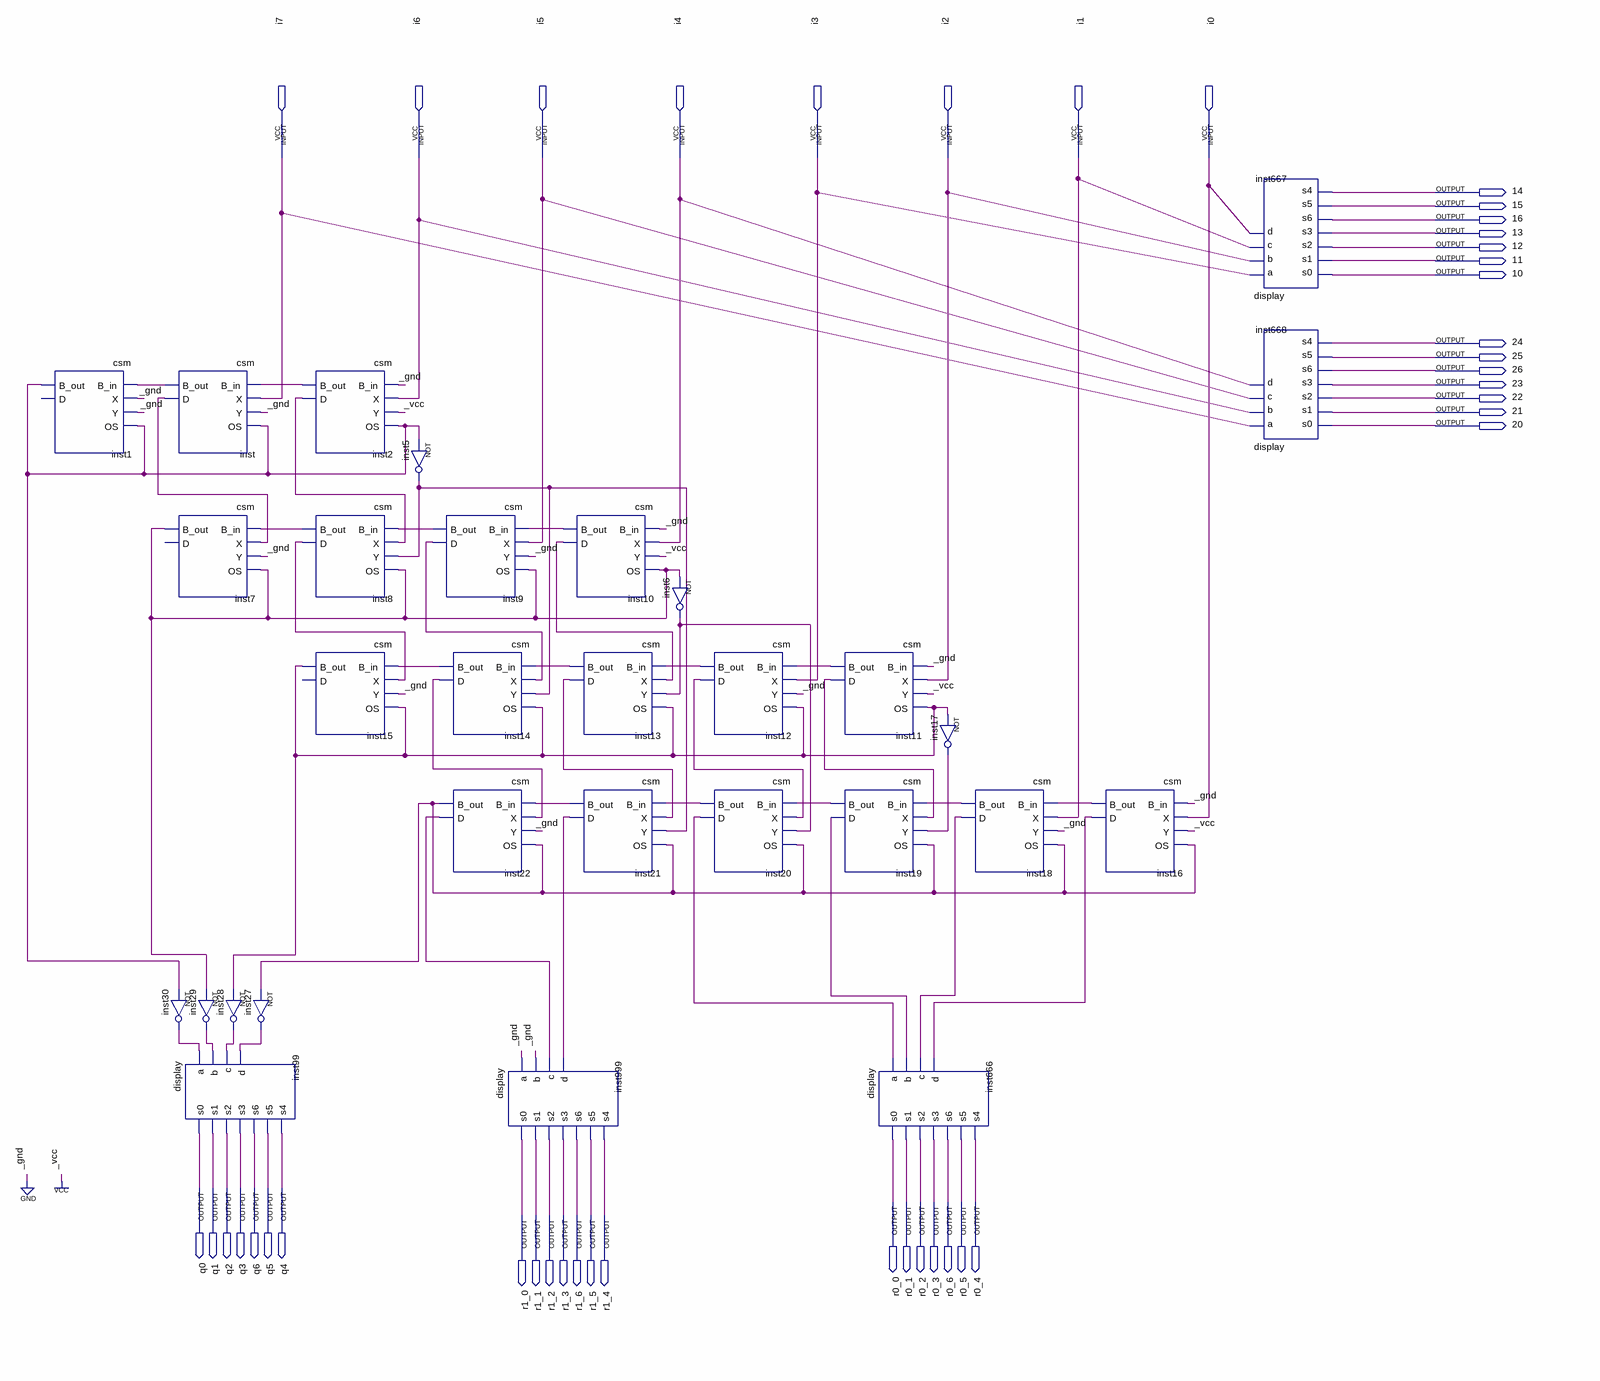
[diagram p0: schematic sheet]
// Quartus schematic aula12.bdf as structural Verilog: 30 symbols, 43 pins
module aula12 (
  input  i7,
  input  i6,
  input  i5,
  input  i4,
  input  i3,
  input  i2,
  input  i1,
  input  i0,
  output \14 ,
  output \15 ,
  output \16 ,
  output \13 ,
  output \12 ,
  output \11 ,
  output \10 ,
  output \24 ,
  output \25 ,
  output \26 ,
  output \23 ,
  output \22 ,
  output \21 ,
  output \20 ,
  output q0,
  output q1,
  output q2,
  output q3,
  output q6,
  output q5,
  output q4,
  output r0_0,
  output r0_1,
  output r0_2,
  output r0_3,
  output r0_6,
  output r0_5,
  output r0_4,
  output r1_0,
  output r1_1,
  output r1_2,
  output r1_3,
  output r1_6,
  output r1_5,
  output r1_4
);

  wire inst1_b_out, inst2_b_out, inst2_d, inst5_out, inst6_out, inst7_b_out, inst8_b_out, inst8_d,
       inst9_b_out, inst9_d, inst10_b_out, inst10_d, inst11_b_out, inst11_d, inst12_b_out, inst12_d,
       inst13_b_out, inst13_d, inst14_b_out, inst14_d, inst15_b_out, inst16_b_out, inst16_d, inst17_out,
       inst18_b_out, inst18_d, inst19_b_out, inst19_d, inst20_b_out, inst20_d, inst21_b_out, inst21_d,
       inst22_b_out, inst22_d, inst27_out, inst28_out, inst29_out, inst30_out, inst_b_out, inst_d;

  csm inst1 (.B_in(inst_b_out), .X(1'b0), .Y(1'b0), .OS(inst1_b_out), .B_out(inst1_b_out));  // open: D
  csm inst (.B_in(inst2_b_out), .X(i7), .Y(1'b0), .OS(inst1_b_out), .B_out(inst_b_out), .D(inst_d));
  csm inst7 (.B_in(inst8_b_out), .X(inst_d), .Y(1'b0), .OS(inst7_b_out), .B_out(inst7_b_out));  // open: D
  not inst30 (inst30_out, inst1_b_out);
  not inst28 (inst28_out, inst15_b_out);
  not inst29 (inst29_out, inst7_b_out);
  display inst99 (
    .a(inst30_out), .b(inst29_out), .c(inst28_out), .d(inst27_out), .s0(q0), .s1(q1), .s2(q2), .s3(q3),
    .s6(q6), .s5(q5), .s4(q4));
  not inst27 (inst27_out, inst22_b_out);
  csm inst2 (.B_in(1'b0), .X(i6), .Y(1'b1), .OS(inst1_b_out), .B_out(inst2_b_out), .D(inst2_d));
  csm inst8 (.B_in(inst9_b_out), .X(inst2_d), .Y(inst5_out), .OS(inst7_b_out), .B_out(inst8_b_out), .D(inst8_d));
  csm inst15 (.B_in(inst14_b_out), .X(inst8_d), .Y(1'b0), .OS(inst15_b_out), .B_out(inst15_b_out));  // open: D
  not inst5 (inst5_out, inst1_b_out);
  csm inst9 (.B_in(inst10_b_out), .X(i5), .Y(1'b0), .OS(inst7_b_out), .B_out(inst9_b_out), .D(inst9_d));
  csm inst14 (.B_in(inst13_b_out), .X(inst9_d), .Y(inst5_out), .OS(inst15_b_out), .B_out(inst14_b_out), .D(inst14_d));
  csm inst22 (.B_in(inst21_b_out), .X(inst14_d), .Y(1'b0), .OS(inst22_b_out), .B_out(inst22_b_out), .D(inst22_d));
  display inst999 (
    .a(1'b0), .b(1'b0), .c(inst22_d), .d(inst21_d), .s0(r1_0), .s1(r1_1), .s2(r1_2), .s3(r1_3), .s6(r1_6),
    .s5(r1_5), .s4(r1_4));
  csm inst10 (.B_in(1'b0), .X(i4), .Y(1'b1), .OS(inst7_b_out), .B_out(inst10_b_out), .D(inst10_d));
  csm inst13 (.B_in(inst12_b_out), .X(inst10_d), .Y(inst6_out), .OS(inst15_b_out), .B_out(inst13_b_out), .D(inst13_d));
  csm inst21 (.B_in(inst20_b_out), .X(inst13_d), .Y(inst5_out), .OS(inst22_b_out), .B_out(inst21_b_out), .D(inst21_d));
  not inst6 (inst6_out, inst7_b_out);
  csm inst12 (.B_in(inst11_b_out), .X(i3), .Y(1'b0), .OS(inst15_b_out), .B_out(inst12_b_out), .D(inst12_d));
  csm inst20 (.B_in(inst19_b_out), .X(inst12_d), .Y(inst6_out), .OS(inst22_b_out), .B_out(inst20_b_out), .D(inst20_d));
  csm inst11 (.B_in(1'b0), .X(i2), .Y(1'b1), .OS(inst15_b_out), .B_out(inst11_b_out), .D(inst11_d));
  csm inst19 (.B_in(inst18_b_out), .X(inst11_d), .Y(inst17_out), .OS(inst22_b_out), .B_out(inst19_b_out), .D(inst19_d));
  display inst666 (
    .a(inst20_d), .b(inst19_d), .c(inst18_d), .d(inst16_d), .s0(r0_0), .s1(r0_1), .s2(r0_2), .s3(r0_3),
    .s6(r0_6), .s5(r0_5), .s4(r0_4));
  not inst17 (inst17_out, inst15_b_out);
  csm inst18 (.B_in(inst16_b_out), .X(i1), .Y(1'b0), .OS(inst22_b_out), .B_out(inst18_b_out), .D(inst18_d));
  csm inst16 (.B_in(1'b0), .X(i0), .Y(1'b1), .OS(inst22_b_out), .B_out(inst16_b_out), .D(inst16_d));
  display inst667 (
    .a(i3), .b(i2), .c(i1), .d(i0), .s0(\10 ), .s1(\11 ), .s2(\12 ), .s3(\13 ), .s6(\16 ), .s5(\15 ),
    .s4(\14 ));
  display inst668 (
    .a(i7), .b(i6), .c(i5), .d(i4), .s0(\20 ), .s1(\21 ), .s2(\22 ), .s3(\23 ), .s6(\26 ), .s5(\25 ),
    .s4(\24 ));
endmodule
